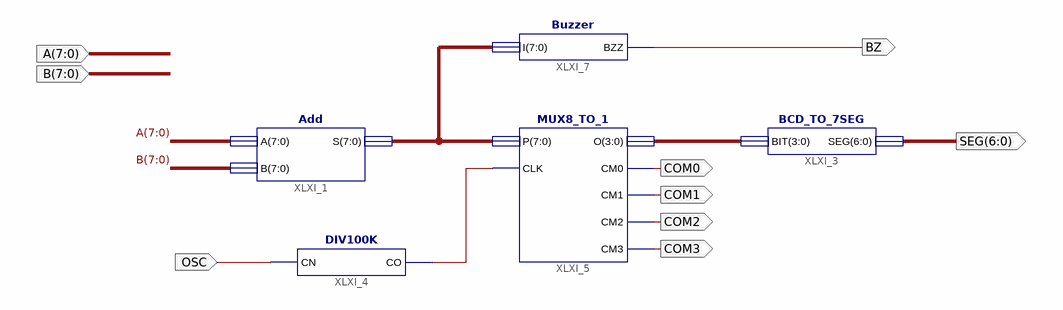
[diagram p0: schematic sheet 1]
// Xilinx ISE schematic Main.sch (spartan6) as structural Verilog: 5 symbols, 9 ports
module Main (
  input  [7:0] A,
  input  [7:0] B,
  input  OSC,
  output [6:0] SEG,
  output COM0,
  output COM1,
  output COM2,
  output COM3,
  output BZ
);

  wire XLXN_23;
  wire [3:0] XLXN_10;
  wire [7:0] XLXN_19;

  Add XLXI_1 (.A(A), .B(B), .S(XLXN_19));
  BCD_TO_7SEG XLXI_3 (.BIT(XLXN_10), .SEG(SEG));
  DIV100K XLXI_4 (.CN(OSC), .CO(XLXN_23));
  MUX8_TO_1 XLXI_5 (.CLK(XLXN_23), .CM0(COM0), .CM1(COM1), .CM2(COM2), .CM3(COM3), .O(XLXN_10), .P(XLXN_19));
  Buzzer XLXI_7 (.BZZ(BZ), .I(XLXN_19));
endmodule
